# Altium schematic sheet SpaceVNXInterface.SchDoc: SpaceVNXInterface
size A4; Author: Carlos Barreiro; Organization: Escuela Técnica Superior de Ingeniería de Sistemas Informáticos de la Universidad Politécnica de Madrid; Address1: Campus Sur de la Universidad Politécnica de Madrid; Address2: Calle de Alan Turing, s/nº; Address3: Madrid 28031; Address4: España; DocumentNumber: 10; Revision: A; SheetNumber: 10; SheetTotal: 16
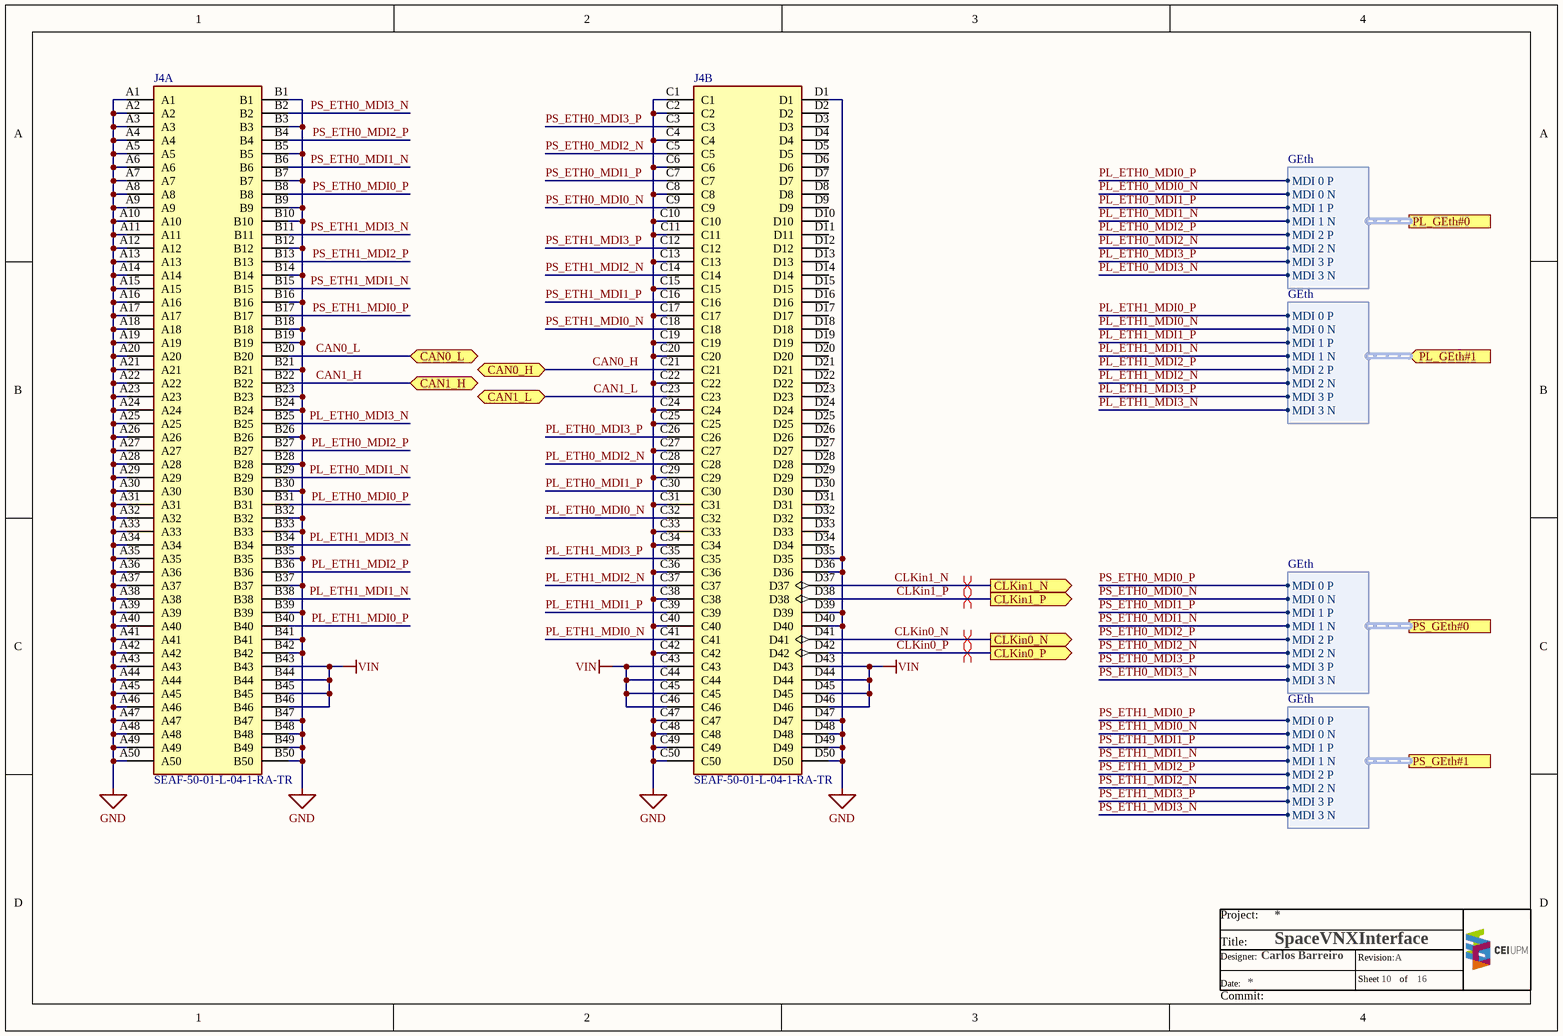
[diagram p0: SpaceVNXInterface.SchDoc]

## Parts
J4  SEAF-50-01-L-04-1-RA-TR  [SAMTEC_SEAF-50-01-L-04-1-RA-TR]  (parts A,B of 2)

## Ports
CAN0_H (bidir), CAN0_L (bidir), CAN1_H (bidir), CAN1_L (bidir), CLKin0_N (out), CLKin0_P (out), CLKin1_N (out), CLKin1_P (out), PL_GEth#0 (harness GEth), PL_GEth#1 (in, harness GEth), PS_GEth#0 (harness GEth), PS_GEth#1 (harness GEth)

## Harnesses
GEth: MDI 0 P, MDI 0 N, MDI 1 P, MDI 1 N, MDI 2 P, MDI 2 N, MDI 3 P, MDI 3 N

## Nets
GND: J4.A1 J4.A2 J4.A3 J4.A4 J4.A5 J4.A6 J4.A7 J4.A8 J4.A9 J4.A10 J4.A11 J4.A12 J4.A13 J4.A14 J4.A15 J4.A16 J4.A17 J4.A18 J4.A19 J4.A20 J4.A21 J4.A22 J4.A23 J4.A24 J4.A25 J4.A26 J4.A27 J4.A28 J4.A29 J4.A30 J4.A31 J4.A32 J4.A33 J4.A34 J4.A35 J4.A36 J4.A37 J4.A38 J4.A39 J4.A40 J4.A41 J4.A42 J4.A43 J4.A44 J4.A45 J4.A46 J4.A47 J4.A48 J4.A49 J4.A50 J4.B1 J4.B3 J4.B5 J4.B7 J4.B9 J4.B10 J4.B12 J4.B14 J4.B16 J4.B18 J4.B19 J4.B21 J4.B23 J4.B24 J4.B26 J4.B28 J4.B30 J4.B32 J4.B33 J4.B35 J4.B37 J4.B39 J4.B41 J4.B42 J4.B47 J4.B48 J4.B49 J4.B50 J4.C1 J4.C2 J4.C4 J4.C6 J4.C8 J4.C10 J4.C11 J4.C13 J4.C15 J4.C17 J4.C19 J4.C20 J4.C22 J4.C24 J4.C25 J4.C27 J4.C29 J4.C31 J4.C33 J4.C34 J4.C36 J4.C38 J4.C40 J4.C42 J4.C47 J4.C48 J4.C49 J4.C50 J4.D1 J4.D35 J4.D36 J4.D39 J4.D40 J4.D47 J4.D48 J4.D49 J4.D50
VIN: J4.B43 J4.B44 J4.B45 J4.B46 J4.C43 J4.C44 J4.C45 J4.C46 J4.D43 J4.D44 J4.D45 J4.D46
CAN0_H: J4.C21 ; port CAN0_H
CAN0_L: J4.B20 ; port CAN0_L
CAN1_H: J4.B22 ; port CAN1_H
CAN1_L: J4.C23 ; port CAN1_L
CLKin0_N: J4.D41 ; port CLKin0_N
CLKin0_P: J4.D42 ; port CLKin0_P
CLKin1_N: J4.D37 ; port CLKin1_N
CLKin1_P: J4.D38 ; port CLKin1_P
PL_ETH0_MDI0_N: J4.C32 ; port PL_GEth#0.MDI 0 N
PL_ETH0_MDI0_P: J4.B31 ; port PL_GEth#0.MDI 0 P
PL_ETH0_MDI1_N: J4.B29 ; port PL_GEth#0.MDI 1 N
PL_ETH0_MDI1_P: J4.C30 ; port PL_GEth#0.MDI 1 P
PL_ETH0_MDI2_N: J4.C28 ; port PL_GEth#0.MDI 2 N
PL_ETH0_MDI2_P: J4.B27 ; port PL_GEth#0.MDI 2 P
PL_ETH0_MDI3_N: J4.B25 ; port PL_GEth#0.MDI 3 N
PL_ETH0_MDI3_P: J4.C26 ; port PL_GEth#0.MDI 3 P
PL_ETH1_MDI0_N: J4.C41 ; port PL_GEth#1.MDI 0 N
PL_ETH1_MDI0_P: J4.B40 ; port PL_GEth#1.MDI 0 P
PL_ETH1_MDI1_N: J4.B38 ; port PL_GEth#1.MDI 1 N
PL_ETH1_MDI1_P: J4.C39 ; port PL_GEth#1.MDI 1 P
PL_ETH1_MDI2_N: J4.C37 ; port PL_GEth#1.MDI 2 N
PL_ETH1_MDI2_P: J4.B36 ; port PL_GEth#1.MDI 2 P
PL_ETH1_MDI3_N: J4.B34 ; port PL_GEth#1.MDI 3 N
PL_ETH1_MDI3_P: J4.C35 ; port PL_GEth#1.MDI 3 P
PS_ETH0_MDI0_N: J4.C9 ; port PS_GEth#0.MDI 0 N
PS_ETH0_MDI0_P: J4.B8 ; port PS_GEth#0.MDI 0 P
PS_ETH0_MDI1_N: J4.B6 ; port PS_GEth#0.MDI 1 N
PS_ETH0_MDI1_P: J4.C7 ; port PS_GEth#0.MDI 1 P
PS_ETH0_MDI2_N: J4.C5 ; port PS_GEth#0.MDI 2 N
PS_ETH0_MDI2_P: J4.B4 ; port PS_GEth#0.MDI 2 P
PS_ETH0_MDI3_N: J4.B2 ; port PS_GEth#0.MDI 3 N
PS_ETH0_MDI3_P: J4.C3 ; port PS_GEth#0.MDI 3 P
PS_ETH1_MDI0_N: J4.C18 ; port PS_GEth#1.MDI 0 N
PS_ETH1_MDI0_P: J4.B17 ; port PS_GEth#1.MDI 0 P
PS_ETH1_MDI1_N: J4.B15 ; port PS_GEth#1.MDI 1 N
PS_ETH1_MDI1_P: J4.C16 ; port PS_GEth#1.MDI 1 P
PS_ETH1_MDI2_N: J4.C14 ; port PS_GEth#1.MDI 2 N
PS_ETH1_MDI2_P: J4.B13 ; port PS_GEth#1.MDI 2 P
PS_ETH1_MDI3_N: J4.B11 ; port PS_GEth#1.MDI 3 N
PS_ETH1_MDI3_P: J4.C12 ; port PS_GEth#1.MDI 3 P

Not connected (* = marked no-connect by the designer): J4 D2 D3 D4 D5 D6 D7 D8 D9 D10 D11 D12 D13 D14 D15 D16 D17 D18 D19 D20 D21 D22 D23 D24 D25 D26 D27 D28 D29 D30 D31 D32 D33 D34

## Layout directives
differential pair: CLKin0_N, CLKin0_P, CLKin1_N, CLKin1_P

## Notes on the sheet
- Project:
- Title:
- Date:
- Designer:
- Sheet
- Revision:
- of
- Commit:

## Library data of the parts
J4 = SEAF-50-01-L-04-1-RA-TR: 200 Position Connector High Density Array, Female Surface Mount, Right Angle Gold  <a href="https://pricing.snapeda.com/parts/SEAF-50-01-L-04-1-RA-K-TR/Samtec/view-part?ref=eda">Check prices</a>; Supplier 1: Digi-Key; Supplier Part Number 1: SEAF-50-01-L-04-1-RA-TR-ND; System: Connector